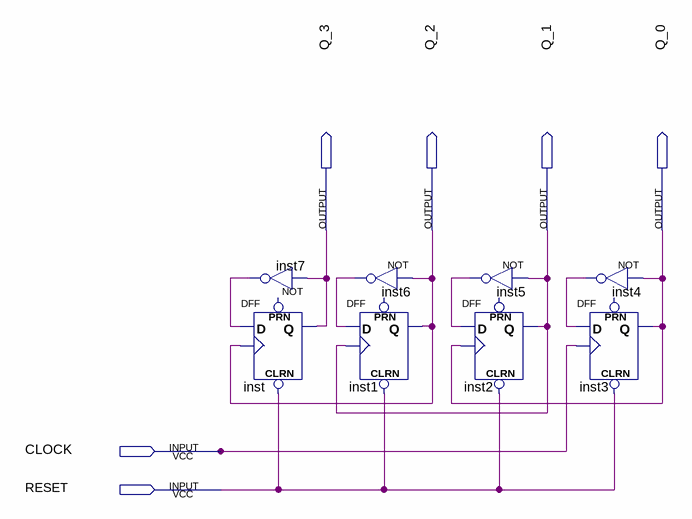
[diagram p0: schematic sheet]
// Quartus schematic ripple_down.bdf as structural Verilog: 8 symbols, 6 pins
module ripple_down (
  input  CLOCK,
  input  RESET,
  output Q_3,
  output Q_2,
  output Q_1,
  output Q_0
);

  wire inst4_out, inst5_out, inst6_out, inst7_out;

  not inst7 (inst7_out, Q_3);
  DFF inst (.CLRN(RESET), .CLK(Q_2), .D(inst7_out), .Q(Q_3));  // open: PRN
  not inst6 (inst6_out, Q_2);
  DFF inst1 (.CLRN(RESET), .CLK(Q_1), .D(inst6_out), .Q(Q_2));  // open: PRN
  not inst5 (inst5_out, Q_1);
  DFF inst2 (.CLRN(RESET), .CLK(Q_0), .D(inst5_out), .Q(Q_1));  // open: PRN
  not inst4 (inst4_out, Q_0);
  DFF inst3 (.CLRN(RESET), .CLK(CLOCK), .D(inst4_out), .Q(Q_0));  // open: PRN
endmodule
